# EAGLE schematic ATX +12V Switching (EAGLE 7.6.0)
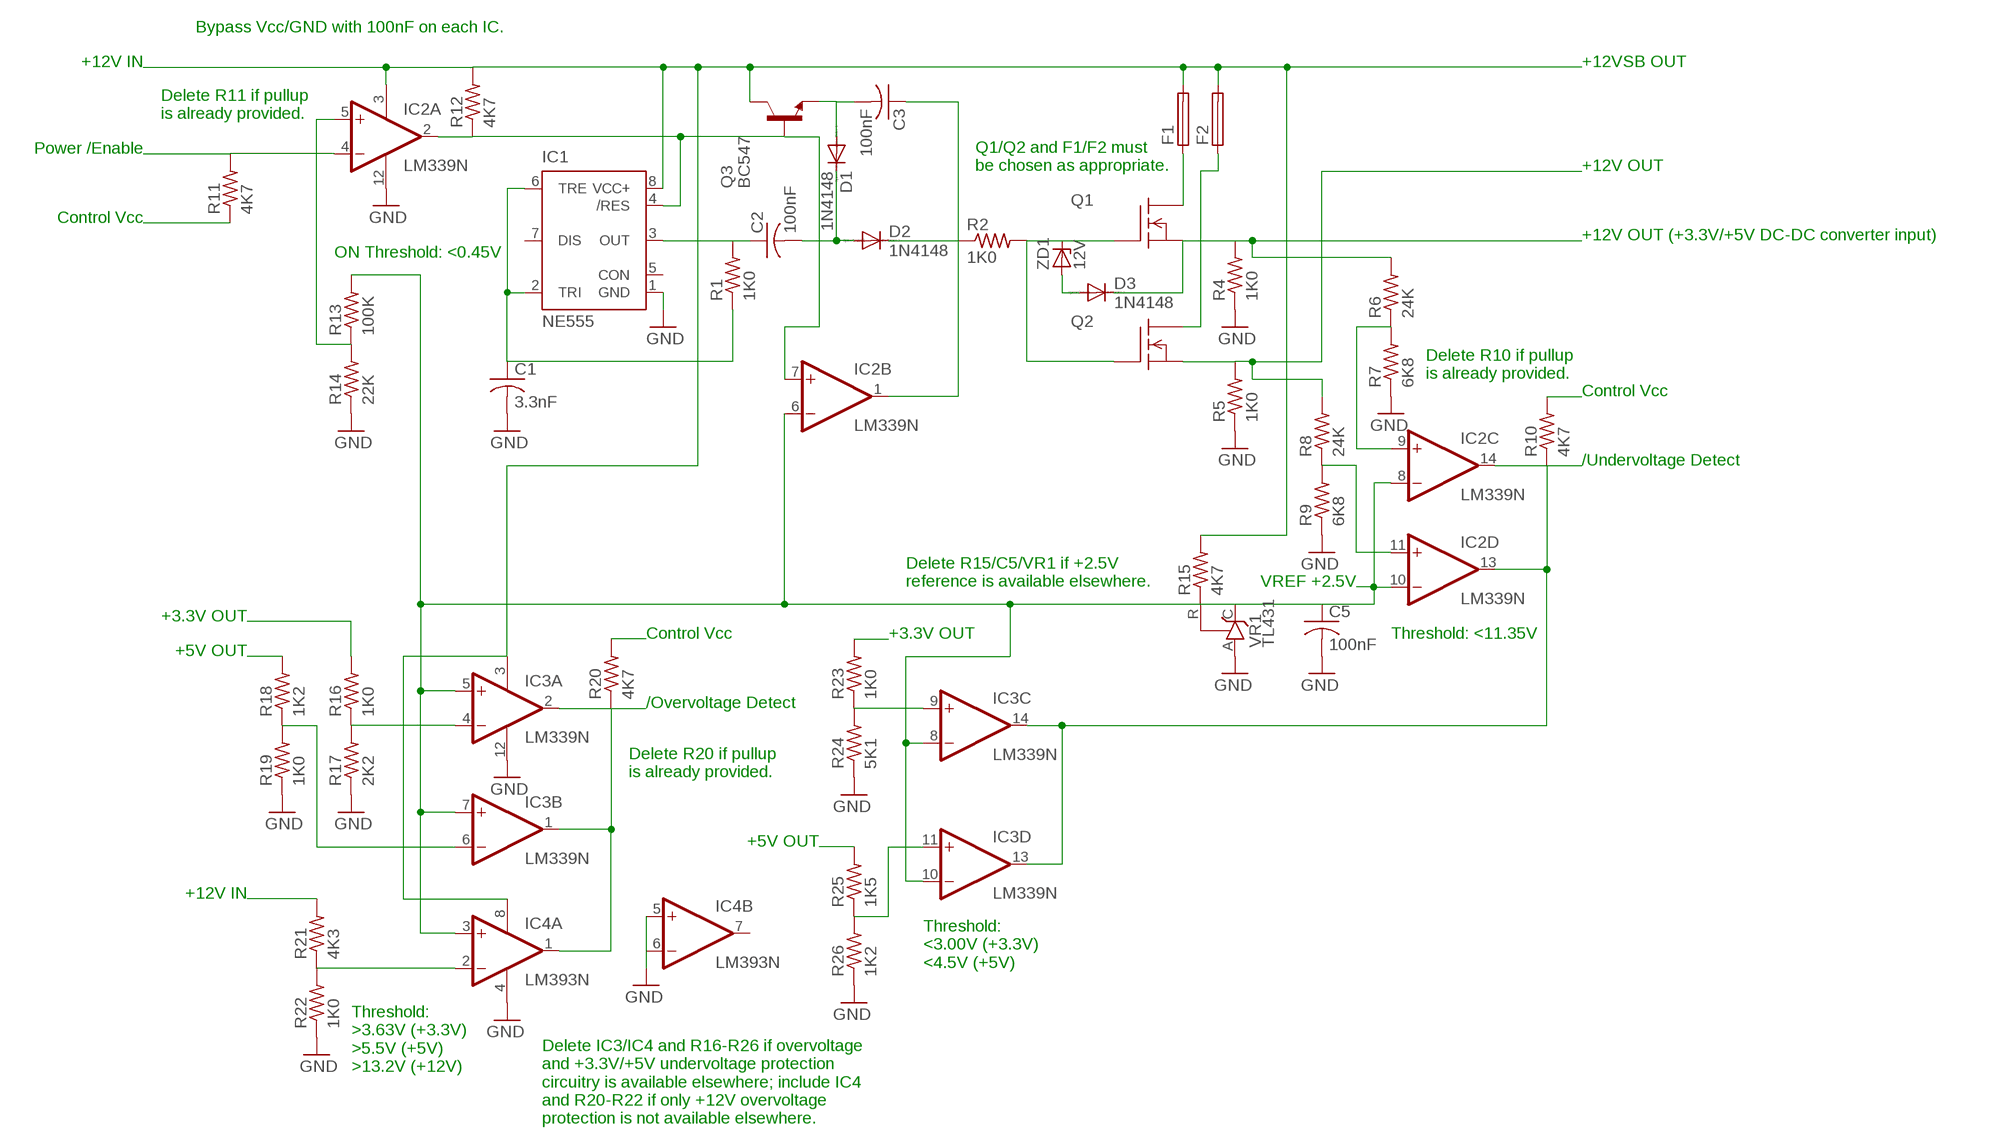
[diagram p0: schematic, sheet 1]

## Parts
C1  3.3nF  C-US025-024X044  [C025-024X044]
C2  100nF  C-US025-024X044  [C025-024X044]
C3  100nF  C-US025-024X044  [C025-024X044]
C5  100nF  C-US025-024X044  [C025-024X044]
D1  1N4148  1N4148DO35-7  [DO35-7]
D2  1N4148  1N4148DO35-7  [DO35-7]
D3  1N4148  1N4148DO35-7  [DO35-7]
F1  19559  [19559]
F2  19559  [19559]
IC1  NE555  [DIL-08]
IC2  LM339N  [DIL14]
IC3  LM339N  [DIL14]
IC4  LM393N  [DIL08]
Q1  BUZ10  [TO220]
Q2  BUZ10  [TO220]
Q3  BC547  [TO92]
R1  1K0  R-US_0204/2V  [0204V]
R2  1K0  R-US_0204/2V  [0204V]
R4  1K0  R-US_0204/2V  [0204V]
R5  1K0  R-US_0204/2V  [0204V]
R6  24K  R-US_0204/2V  [0204V]
R7  6K8  R-US_0204/2V  [0204V]
R8  24K  R-US_0204/2V  [0204V]
R9  6K8  R-US_0204/2V  [0204V]
R10  4K7  R-US_0204/2V  [0204V]
R11  4K7  R-US_0204/2V  [0204V]
R12  4K7  R-US_0204/2V  [0204V]
R13  100K  R-US_0204/2V  [0204V]
R14  22K  R-US_0204/2V  [0204V]
R15  4K7  R-US_0204/2V  [0204V]
R16  1K0  R-US_0204/2V  [0204V]
R17  2K2  R-US_0204/2V  [0204V]
R18  1K2  R-US_0204/2V  [0204V]
R19  1K0  R-US_0204/2V  [0204V]
R20  4K7  R-US_0204/2V  [0204V]
R21  4K3  R-US_0204/2V  [0204V]
R22  1K0  R-US_0204/2V  [0204V]
R23  1K0  R-US_0204/2V  [0204V]
R24  5K1  R-US_0204/2V  [0204V]
R25  1K5  R-US_0204/2V  [0204V]
R26  1K2  R-US_0204/2V  [0204V]
VR1  TL431  TL431CLP  [TO92-CLP]
ZD1  12V  ZENER-DIODEC1702-15  [C1702-15]

## Nets
GND: C1.2 C5.2 IC1.1(GND) IC2.12(P:GND) IC3.12(P:GND) IC4.4(P:V-) IC4.5(B:+IN) IC4.6(B:-IN) R4.1 R5.1 R7.1 R9.1 R14.1 R17.1 R19.1 R22.1 R24.1 R26.1 VR1.A
N$1: C1.1 IC1.2(TRI) IC1.6(TRE) R1.1
N$2: D3.A ZD1.A
N$3: IC1.4(/RES) IC2.2(A:OUT) IC2.7(B:+IN) Q3.2(B) R12.1
N$4: C2.1 IC1.3(OUT) R1.2
N$5: C2.2 D1.C D2.A
N$6: IC2.5(A:+IN) R13.1 R14.2
N$7: C3.1 D2.C IC2.1(B:OUT) R2.1
N$8: Q1.1(G) Q2.1(G) R2.2 ZD1.C
N$9: C3.2 D1.A Q3.1(E)
N$10: Q2.3(S) R5.2 R8.2
N$11: D3.C Q1.3(S) R4.2 R6.2
N$12: F1.1 Q1.2(D)
N$13: R11.1
N$14: IC2.4(A:-IN) R11.2
N$15: IC2.9(C:+IN) R6.1 R7.2
N$16: IC2.11(D:+IN) R8.1 R9.2
N$17: F2.1 Q2.2(D)
N$18: R10.2
N$19: F1.2 F2.2 IC1.8(VCC+) IC2.3(P:V+) IC3.3(P:V+) IC4.8(P:V+) Q3.3(C) R12.2 R15.2
N$20: IC3.4(A:-IN) R16.1 R17.2
N$21: IC3.6(B:-IN) R18.1 R19.2
N$22: IC3.1(B:OUT) IC3.2(A:OUT) IC4.1(A:OUT) R20.1
N$23: R20.2
N$24: R18.2
N$25: R16.2
N$26: R21.2
N$27: IC4.2(A:-IN) R21.1 R22.2
N$28: IC3.9(C:+IN) R23.1 R24.2
N$29: IC3.11(D:+IN) R25.1 R26.2
N$31: R23.2
N$32: R25.2
N$33: C5.1 IC2.6(B:-IN) IC2.8(C:-IN) IC2.10(D:-IN) IC3.5(A:+IN) IC3.7(B:+IN) IC3.8(C:-IN) IC3.10(D:-IN) IC4.3(A:+IN) R13.2 R15.1 VR1.C VR1.R
N$34: IC2.13(D:OUT) IC2.14(C:OUT) IC3.13(D:OUT) IC3.14(C:OUT) R10.1
Unconnected: IC1.5(CON) IC1.7(DIS) IC4.7(B:OUT)

## Notes on the sheet
- Bypass Vcc/GND with 100nF on each IC.
- +12V IN | +12VSB OUT
- Delete R11 if pullup
  is already provided.
- Power /Enable
- Q1/Q2 and F1/F2 must
  be chosen as appropriate.
- +12V OUT
- Control Vcc
- +12V OUT (+3.3V/+5V DC-DC converter input)
- ON Threshold: <0.45V
- Delete R10 if pullup
  is already provided.
- Control Vcc
- /Undervoltage Detect
- Delete R15/C5/VR1 if +2.5V
  reference is available elsewhere.
- VREF +2.5V
- +3.3V OUT
- Control Vcc | +3.3V OUT | Threshold: <11.35V
- +5V OUT
- /Overvoltage Detect
- Delete R20 if pullup
  is already provided.
- +5V OUT
- +12V IN
- Threshold:
  <3.00V (+3.3V)
  <4.5V (+5V)
- Threshold:
  >3.63V (+3.3V)
  >5.5V (+5V)
  >13.2V (+12V)
- Delete IC3/IC4 and R16-R26 if overvoltage
  and +3.3V/+5V undervoltage protection
  circuitry is available elsewhere; include IC4
  and R20-R22 if only +12V overvoltage
  protection is not available elsewhere.

## Library data of the parts
C1-C3 C5 = rcl:C-US: CAPACITOR, American symbol
D1-D3 = diode:1N4148: DIODE high speed (Philips)
F1 F2 = fuse:19559: FUSE HOLDER TR5, Wickmann; MPN: 55900000001; OC_FARNELL: 9516360; OC_NEWARK: 02P0286
IC1 = st-microelectronics:NE555: General purpose bipolar Timer; MF: Arrow Electronics; MPN: NE555N; OC_FARNELL: 1467742; OC_NEWARK: 89K1486
IC2 IC3 = linear:LM339: Low Power Low Offset Voltage Quad Comparators with open collector; LM139/LM239/LM339/LM2901/LM3302
IC4 = linear:LM393: COMPARATOR
Q1 Q2 = transistor-fet:BUZ10: N-Channel Enhancement MOSFET 50V; 20A; 0,080Ohm
Q3 = transistor-npn:BC547*: NPN Transistor
R1 R2 R4-R26 = rcl:R-US_: RESISTOR, American symbol
VR1 = v-reg:TL431CLP: VOLTAGE REGULATOR
ZD1 = diode:ZENER-DIODE: Z-Diode